# Altium schematic sheet MAIN.SchDoc: Main Schematic
size 431 x 279 mm; Author: Changran Liu / Kaiwen Zhou; CompanyName: Upenn; DrawnBy: Changran Liu / Kaiwen Zhou; Engineer: Changran Liu / Kaiwen Zhou; Organization: Upenn; DocumentNumber: 1; SheetNumber: 1; SheetTotal: 9
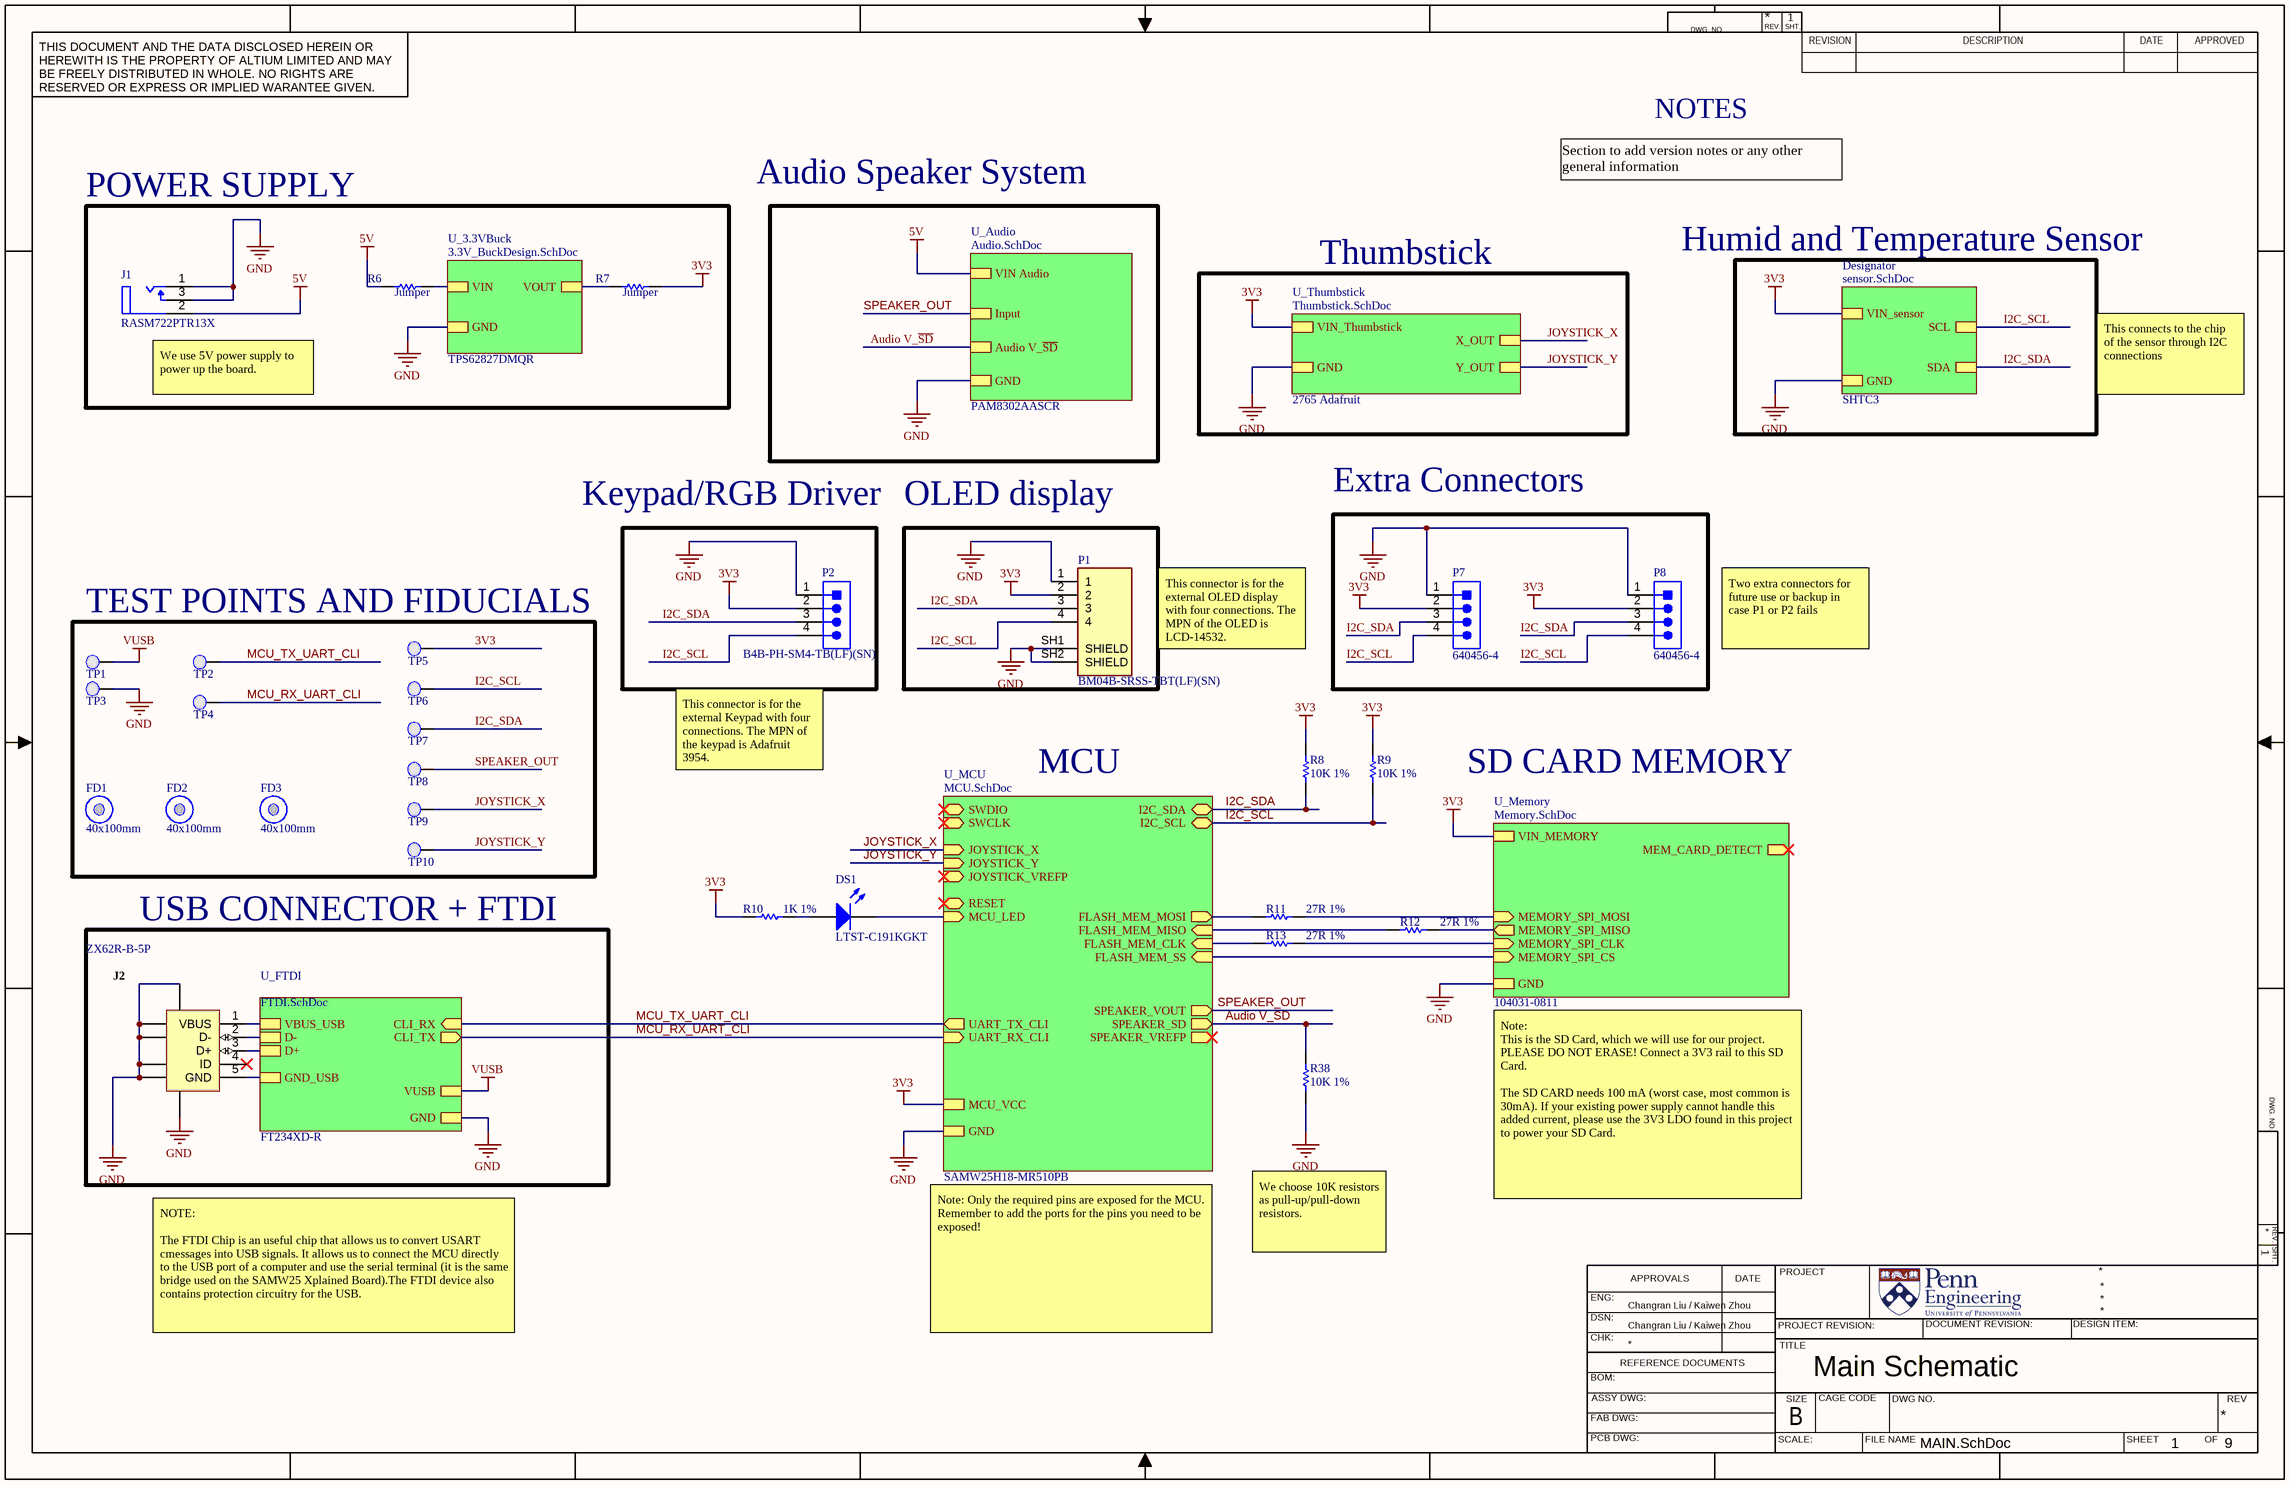
[diagram p0: MAIN.SchDoc]

## Parts
DS1  LTST-C191KGKT  [LITE-ON-LTST-C191KRKT-2_V]
FD1  40x100mm  [Fiducial_FT]
FD2  40x100mm  [Fiducial_FT]
FD3  40x100mm  [Fiducial_FT]
J1  RASM722PTR13X  [FP-RASM722PTR13X-MFG]
J2  ZX62R-B-5P  [HIRO-ZX62R-B-5P_V]
P1  BM04B-SRSS-TBT(LF)(SN)  [CONN_BM04B-SRSS-TBT(LF)(SN)]
P2  B4B-PH-SM4-TB(LF)(SN)  [TECO-640456-4]
P7  640456-4  [TECO-640456-4]
P8  640456-4  [TECO-640456-4]
R6  Jumper  [RESC0603(1608)_N]
R7  Jumper  [RESC0603(1608)_N]
R8  10K 1%  [RESC0603(1608)_N]
R9  10K 1%  [RESC0603(1608)_N]
R10  1K 1%  [RESC0603(1608)_N]
R11  27R 1%  [RESC0603(1608)_N]
R12  27R 1%  [RESC0603(1608)_N]
R13  27R 1%  [RESC0603(1608)_N]
R38  10K 1%  [RESC0603(1608)_N]
TP1  0.1" Pad  [PCBComponent]  (value not drawn)
TP2  0.1" Pad  [PCBComponent]  (value not drawn)
TP3  0.1" Pad  [PCBComponent]  (value not drawn)
TP4  0.1" Pad  [PCBComponent]  (value not drawn)
TP5  0.1" Pad  [PCBComponent]  (value not drawn)
TP6  0.1" Pad  [PCBComponent]  (value not drawn)
TP7  0.1" Pad  [PCBComponent]  (value not drawn)
TP8  0.1" Pad  [PCBComponent]  (value not drawn)
TP9  0.1" Pad  [PCBComponent]  (value not drawn)
TP10  0.1" Pad  [PCBComponent]  (value not drawn)

## Blocks framed on the sheet
POWER SUPPLY: J1 R6 R7
OLED display: P1
Extra Connectors: P7 P8
TEST POINTS AND FIDUCIALS: FD1-FD3 TP1-TP10
USB CONNECTOR + FTDI: J2

## Sub-sheets
Designator = sensor.SchDoc: VIN_sensor, SCL, SDA, GND  | MPN: SHTC3
U_3.3VBuck = 3.3V_BuckDesign.SchDoc: VIN, GND, VOUT  | MPN: TPS62827DMQR
U_Audio = Audio.SchDoc: VIN Audio, Input, GND, Audio V_~{SD}  | MPN: PAM8302AASCR
U_FTDI = FTDI.SchDoc: CLI_RX (in), CLI_TX (out), VUSB, GND, VBUS_USB, D-, D+, GND_USB  | MPN: FT234XD-R
U_MCU = MCU.SchDoc: SWDIO (bidir), SWCLK (in), UART_TX_CLI (out), UART_RX_CLI (in), FLASH_MEM_SS (in), FLASH_MEM_CLK (in), FLASH_MEM_MISO (in), FLASH_MEM_MOSI (out), RESET (bidir), MCU_LED (in), MCU_VCC, GND, JOYSTICK_X (in), JOYSTICK_Y (in), JOYSTICK_VREFP (in), I2C_SDA (bidir), I2C_SCL (bidir), SPEAKER_VOUT (out), SPEAKER_VREFP (out), SPEAKER_SD (out)  | MPN: SAMW25H18-MR510PB
U_Memory = Memory.SchDoc: MEMORY_SPI_MOSI (in), MEMORY_SPI_MISO (out), MEMORY_SPI_CLK (in), MEMORY_SPI_CS (in), MEM_CARD_DETECT (out), VIN_MEMORY, GND  | MPN: 104031-0811
U_Thumbstick = Thumbstick.SchDoc: VIN_Thumbstick, GND, X_OUT, Y_OUT  | MPN: 2765 Adafruit

## Nets
3V3: P1.2 P2.2 P7.2 P8.2 R7.2 R8.2 R9.2 R10.1 TP5.1(PAD) ; sheet U_MCU/MCU_VCC, sheet U_Memory/VIN_MEMORY, sheet U_Thumbstick/VIN_Thumbstick, sheet Designator/VIN_sensor
5V: J1.2(SLEEVE_TERMINAL) R6.1 ; sheet U_Audio/VIN Audio
GND: J1.1(TIP_TERMINAL(CENTER_PIN)) J1.3(SHUNT_TERMINAL) J2.6(SHLD) J2.7(SHLD) J2.8(SHLD) J2.9(SHLD) J2.10(SHLD) J2.11(SHLD) P1.1 P1.SH1(SHIELD) P1.SH2(SHIELD) P2.1 P7.1 P8.1 R38.1 TP3.1(PAD) ; sheet U_FTDI/GND, sheet U_MCU/GND, sheet U_Memory/GND, sheet U_3.3VBuck/GND, sheet U_Audio/GND, sheet U_Thumbstick/GND, sheet Designator/GND
VUSB: TP1.1(PAD) ; sheet U_FTDI/VUSB
Audio V_~{SD}: R38.2 ; sheet U_MCU/SPEAKER_SD, sheet U_Audio/Audio V_~{SD}
I2C_SCL: P1.4 P2.4 P7.4 P8.4 R9.1 TP6.1(PAD) ; sheet U_MCU/I2C_SCL, sheet Designator/SCL
I2C_SDA: P1.3 P2.3 P7.3 P8.3 R8.1 TP7.1(PAD) ; sheet U_MCU/I2C_SDA, sheet Designator/SDA
JOYSTICK_X: TP9.1(PAD) ; sheet U_MCU/JOYSTICK_X, sheet U_Thumbstick/X_OUT
JOYSTICK_Y: TP10.1(PAD) ; sheet U_MCU/JOYSTICK_Y, sheet U_Thumbstick/Y_OUT
MCU_RX_UART_CLI: TP4.1(PAD) ; sheet U_FTDI/CLI_TX, sheet U_MCU/UART_RX_CLI
MCU_TX_UART_CLI: TP2.1(PAD) ; sheet U_FTDI/CLI_RX, sheet U_MCU/UART_TX_CLI
SPEAKER_OUT: TP8.1(PAD) ; sheet U_MCU/SPEAKER_VOUT, sheet U_Audio/Input
NetDS1_1: DS1.1(A) R10.2
NetDS1_2: DS1.2(K) ; sheet U_MCU/MCU_LED
NetJ2_1: J2.1(VBUS) ; sheet U_FTDI/VBUS_USB
NetJ2_2: J2.2(D-) ; sheet U_FTDI/D-
NetJ2_3: J2.3(D+) ; sheet U_FTDI/D+
NetJ2_5: J2.5(GND) ; sheet U_FTDI/GND_USB
NetR6_2: R6.2 ; sheet U_3.3VBuck/VIN
NetR7_1: R7.1 ; sheet U_3.3VBuck/VOUT
NetR11_1: R11.1 ; sheet U_MCU/FLASH_MEM_MOSI
NetR11_2: R11.2 ; sheet U_Memory/MEMORY_SPI_MOSI
NetR12_1: R12.1 ; sheet U_MCU/FLASH_MEM_MISO
NetR12_2: R12.2 ; sheet U_Memory/MEMORY_SPI_MISO
NetR13_1: R13.1 ; sheet U_MCU/FLASH_MEM_CLK
NetR13_2: R13.2 ; sheet U_Memory/MEMORY_SPI_CLK
(unnamed): sheet U_MCU/FLASH_MEM_SS, sheet U_Memory/MEMORY_SPI_CS

Not connected (* = marked no-connect by the designer): J2 4(ID)*

## Notes on the sheet
- NOTES
- Audio Speaker System
- Section to add version notes or any other general information
- Thumbstick
- Humid and Temperature Sensor
- (near J1) We use 5V power supply to power up the board.
- This connects to the chip of the sensor through I2C connections
- Keypad/RGB Driver
- This connector is for the external OLED display with four connections. The MPN of the OLED is LCD-14532.
- Two extra connectors for future use or backup in case P1 or P2 fails
- This connector is for the external Keypad with four connections. The MPN of the keypad is Adafruit 3954.
- MCU
- SD CARD MEMORY
- Note:
  This is the SD Card, which we will use for our project. PLEASE DO NOT ERASE! Connect a 3V3 rail to this SD Card.
  The SD CARD needs 100 mA (worst case, most common is 30mA). If your existing power supply cannot handle this added current, please use the 3V3 LDO found in this project to power your SD Card.
- We choose 10K resistors as pull-up/pull-down resistors.
- NOTE:
  The FTDI Chip is an useful chip that allows us to convert USART cmessages into USB signals. It allows us to connect the MCU directly to the USB port of a computer and use the serial terminal (it is the same bridge used on the SAMW25 Xplained Board).The FTDI device also contains protection circuitry for the USB.
- Note: Only the required pins are exposed for the MCU. Remember to add the ports for the pins you need to be exposed!
- DWG. NO.
- REV.
- SHT.
- THIS DOCUMENT AND THE DATA DISCLOSED HEREIN OR HEREWITH IS THE PROPERTY OF ALTIUM LIMITED AND MAY BE FREELY DISTRIBUTED IN WHOLE. NO RIGHTS ARE RESERVED OR EXPRESS OR IMPLIED WARANTEE GIVEN.
- REVISION
- DESCRIPTION
- DATE
- APPROVED
- ENG:
- APPROVALS
- PROJECT
- DSN:
- CHK:
- REFERENCE DOCUMENTS
- PROJECT REVISION:
- TITLE
- DOCUMENT REVISION:
- DESIGN ITEM:
- BOM:
- FAB DWG:
- PCB DWG:
- ASSY DWG:
- SCALE:
- SIZE
- B
- CAGE CODE
- FILE NAME
- DWG NO.
- SHEET
- OF
- REV

## Library data of the parts
DS1 = CMP-2000-05198-1: Chip LED, Green, 574 nm, 40 pF, -55 to 85 degC, 2-Pin SMD, RoHS, Tape and Reel; Manufacturer: Lite-On; Rad Hardened: No; Emitting Color: YellowGreen; Product Height (mm): 0.55mm; Forward Voltage: 2.4V; Number of Elements: 1; Dominant Wave Length: 571nm; DELETED: Compliant; Viewing Angle: 130deg; High Brightness: Yes; Peak Wavelength: 574nm; Type: Uni-Color; Forward Current: 30mA; Product Length (mm): 1.6mm; Luminous Intensity: 35mcd; Test Current (It): 20mA; Chip Material: AlGaInP; Product Depth (mm): 0.8mm; Shape Type: Rectangular; Reverse Voltage: 5V; Power Dissipation: 75W; Pin Count: 2; Lens Dimensions: 1.1X0.8X0.37mm; Packaging: TapeandReel; Main Category: ChipLED; Operating Temperature Classification: Industrial; Package Type: ChipLed; Mounting: SurfaceMount; Lum Intensity: 35mcd; Operating Temp Range: -55Cto85C; Datasheet Version: Jan-07; Datasheet URL: http://download.siliconexpert.com/pdfs/2007/08/26/semi_b/manual/lot/ds/ltst-c191kgkt.pdf; Manufacturer URL: http://www.us.liteon.com/
FD1-FD3 = CMP-00174-A.4: Fiducial 40x100mm
J1 = CMP-47995-000002-1: CONN PWR JACK 2.1X5.5MM SOLDER; Manufacturer: Switchcraft; Shielding: Unshielded; Gender: Male; Current Rating: 5A; Termination: Solder; Contact Material: Copper Alloy; Package Quantity: 120; Case/Package: SMD/SMT; Contact Plating: Tin; Connector Type: Jack; Housing Material: Thermoplastic; Mount: Surface Mount; Housing Color: Black; Color: Black; Supplier 1: Digi-Key; Supplier Part Number 1: SC2028-1-ND; RoHS: Yes; Category: Power Connectors; Stock 1: 5317; Pricing 1: 1=2.04000, 10=1.95800, 25=1.79520, 50=1.71360 (USD); ComponentLink1URL: https://datasheet.ciiva.com/17/edg4-17820.pdf?src-supplier=Digi-Key; ComponentLink1Description: https://datasheet.ciiva.com/17/edg4-17820.pdf?src-supplier=Digi-Key; ComponentLink2URL: https://datasheet.ciiva.com/18496/edg4-18496955.pdf?src-supplier=Digi-Key; ComponentLink2Description: https://datasheet.ciiva.com/18496/edg4-18496955.pdf?src-supplier=Digi-Key; ComponentLink3URL: https://datasheet.ciiva.com/18496/edg4-18496956.pdf?src-supplier=Digi-Key; ComponentLink3Description: https://datasheet.ciiva.com/18496/edg4-18496956.pdf?src-supplier=Digi-Key; ComponentLink4URL: https://datasheet.ciiva.com/18496/edg4-18496957.pdf?src-supplier=Digi-Key; ComponentLink4Description: https://datasheet.ciiva.com/18496/edg4-18496957.pdf?src-supplier=Digi-Key; Manufacturer Part Number: RASM722PTR13X
J2 = CMP-0031-00001-1: Connector; USBMicro-B,Reverse type, SMT; 5 Position; Right Angle; DatasheetVersion: 08/2010; Operating Temperature: -30 to 85 degC; Mounting Technology: Surface Mount; PartNumber: ZX62R-B-5P; PackageReference: ZX62R-B-5P; ComponentLink2URL: http://www.hirose.co.jp/cataloge_hp/e24200011.pdf; ComponentLink1URL: http://www.hirose.com/â€Ž; ComponentLink2Description: Datasheet; PackageDescription: 5-Pin USB Micro-B R/A Connector; ComponentLink1Description: Manufacturer URL
P1 = BM04B-SRSS-TBT(LF)(SN): Connector Header Surface Mount 4 position 0.039 _1.00mm_; MF: JST Sales; MP: BM04B-SRSS-TBT_LF__SN_; Price: None; Availability: Unavailable; SnapEDA_Link: https://www.snapeda.com/parts/BM04B-SRSS-TBT%28LF%29%28SN%29/JST%20Sales%20America%20Inc./view-part/1647403/?ref=snap; Value: *; Package: None
P2 = B4B-PH-SM4-TB(LF)(SN): Manufacturer: JST; Connector Type: Male Pin; Contact Resistance: 20mR; Current Rating: 2A; Voltage Rating (AC): 100V; Number of Poles: 4; Gender: Male; Insulation Resistance: 1GR; Pitch: 2mm; Supplier 1: Digi-Key; Supplier Part Number 1: 455-1736-1-ND; Manufacturer Part Number: B4B-PH-SM4-TB(LF)(SN); RoHS: Yes; Category: Connectors; Mount: Surface Mount; Housing Material: Polyamide; Contact Plating: Tin,Copper; Contact Material: Copper Alloy,Bronze,Tin,Brass; Color: Natural,White; Housing Color: Beige; Min Operating Temperature: -25°C; Max Operating Temperature: 85°C; Number of Rows: 1; Voltage Rating: 100V; Max Current Rating: 2A; Packaging: Tape and Reel; Number of Positions: 4; Termination: Solder; Fastening Type: Detent; Number of Contacts: 4; Max Voltage Rating (AC): 100V; Working Voltage: 100V; Orientation: Straight; Length: 11.95mm; Width: 5.5mm; Height: 9.4mm; Lead Pitch: 2mm; Contact Mating Length: 0.13inch; Depth: 5mm; Lead Free: Lead Free; Flammability Rating: UL94 V-0; REACH SVHC: No SVHC; ComponentLink1URL: https://datasheet.ciiva.com/8052/1699381-8052048.pdf?src-supplier=Element14; ComponentLink1Description: https://datasheet.ciiva.com/8052/1699381-8052048.pdf?src-supplier=Element14; ComponentLink2URL: https://datasheet.ciiva.com/11747/0900766b80ddea81-11747504.pdf?src-supplier=RSComponents; ComponentLink2Description: https://datasheet.ciiva.com/11747/0900766b80ddea81-11747504.pdf?src-supplier=RSComponents; ComponentLink3URL: https://datasheet.ciiva.com/6747/80567-6747409.pdf?src-supplier=Newark; ComponentLink3Description: https://datasheet.ciiva.com/6747/80567-6747409.pdf?src-supplier=Newark; ComponentLink4URL: https://datasheet.ciiva.com/727/eph-727525.pdf?src-supplier=Digi-Key; ComponentLink4Description: https://datasheet.ciiva.com/727/eph-727525.pdf?src-supplier=Digi-Key; ComponentLink5URL: https://datasheet.ciiva.com/712/eph-712582.pdf?src-supplier=Digi-Key; ComponentLink5Description: https://datasheet.ciiva.com/712/eph-712582.pdf?src-supplier=Digi-Key; ComponentLink6URL: https://datasheet.ciiva.com/712/eph-712583.pdf?src-supplier=Digi-Key; ComponentLink6Description: https://datasheet.ciiva.com/712/eph-712583.pdf?src-supplier=Digi-Key
P7 P8 = CMP-2000-05419-1: Male Header, Pitch 2.54 mm, 1 x 4 Position, Height 10.03 mm, Tail Length 3.56 mm, RoHS, Bulk; Manufacturer: TE Connectivity; Material, Housing: Polyester; Primary Type: InterconnectSystem; Mount Angle: Vertical; Color, Housing: White; Current, Rating: 5 / A; Agency Approvals: CSA,UL; Contact Termination Area Plating: Tin; Temperature, Operating: -55to+105 / degC; Standards: RoHSCompliant,ELVCompliant,UL94V-0; Number of Positions: 4; Brand/Series: MTA-100Series; Angle: Straight; Pin Spacing: 0.1 / "; Material, Contact: CopperAlloy; Connector Type: MTA-100; Special Features: Pinstrip; Mounting Hole Size: 0.04 / "; Contact Centerline Spacing: 0.100 / in.; Voltage, Rating: 250 / V; Manufacturer URL: http://www.te.com/; Length, Pin: 0.14 / "; Length, Overall: 0.4 / "; Color: White; Flammability Rating: UL94V-0; Mounting Type: PCMount; Termination: Solder; Datasheet URL: https://datasheet.ciiva.com/16286/eng-ds-82056-mta-0608-16286228.pdf; Number of Contacts: 4; Contact Shape: Square; Contact Mating Area Plating: Tin; Length, Terminal Post: 0.14 / in.; Size, Post: 0.025 / in.; Contact Plating: Tin; Type: PCBPlug; Datasheet Version: Dec-14; Number of Rows: 1
R6 R7 = CMP-1012-00001-1: Jumper 0603 (1608 Metric); Case-Metric: 1608; Value: 0.00 Ohm; Power: None; Case-EIA: 0603; Technology: SMT; Tolerance: None
R8 R9 R38 = CMP-1012-00623-1: 10K 0.1W 1% 0603 (1608 Metric)  SMD; Value: 10000.00 Ohm; Case-EIA: 0603; Case-Metric: 1608; Power: 0.1 W; Tolerance: 1 %; Technology: SMT
R10 = CMP-1012-00510-1: 1K 0.1W 1% 0603 (1608 Metric)  SMD; Case-Metric: 1608; Case-EIA: 0603; Value: 1000.00 Ohm; Technology: SMT; Tolerance: 1 %; Power: 0.1 W
R11-R13 = CMP-1012-00331-1: 27R 0.1W 1% 0603 (1608 Metric)  SMD; Case-EIA: 0603; Value: 27.00 Ohm; Case-Metric: 1608; Technology: SMT; Tolerance: 1 %; Power: 0.1 W
TP1-TP10 = 0.1" Pad-A.4